# Altium schematic sheet Power.SchDoc
size A3; SheetNumber: 3; SheetTotal: 23
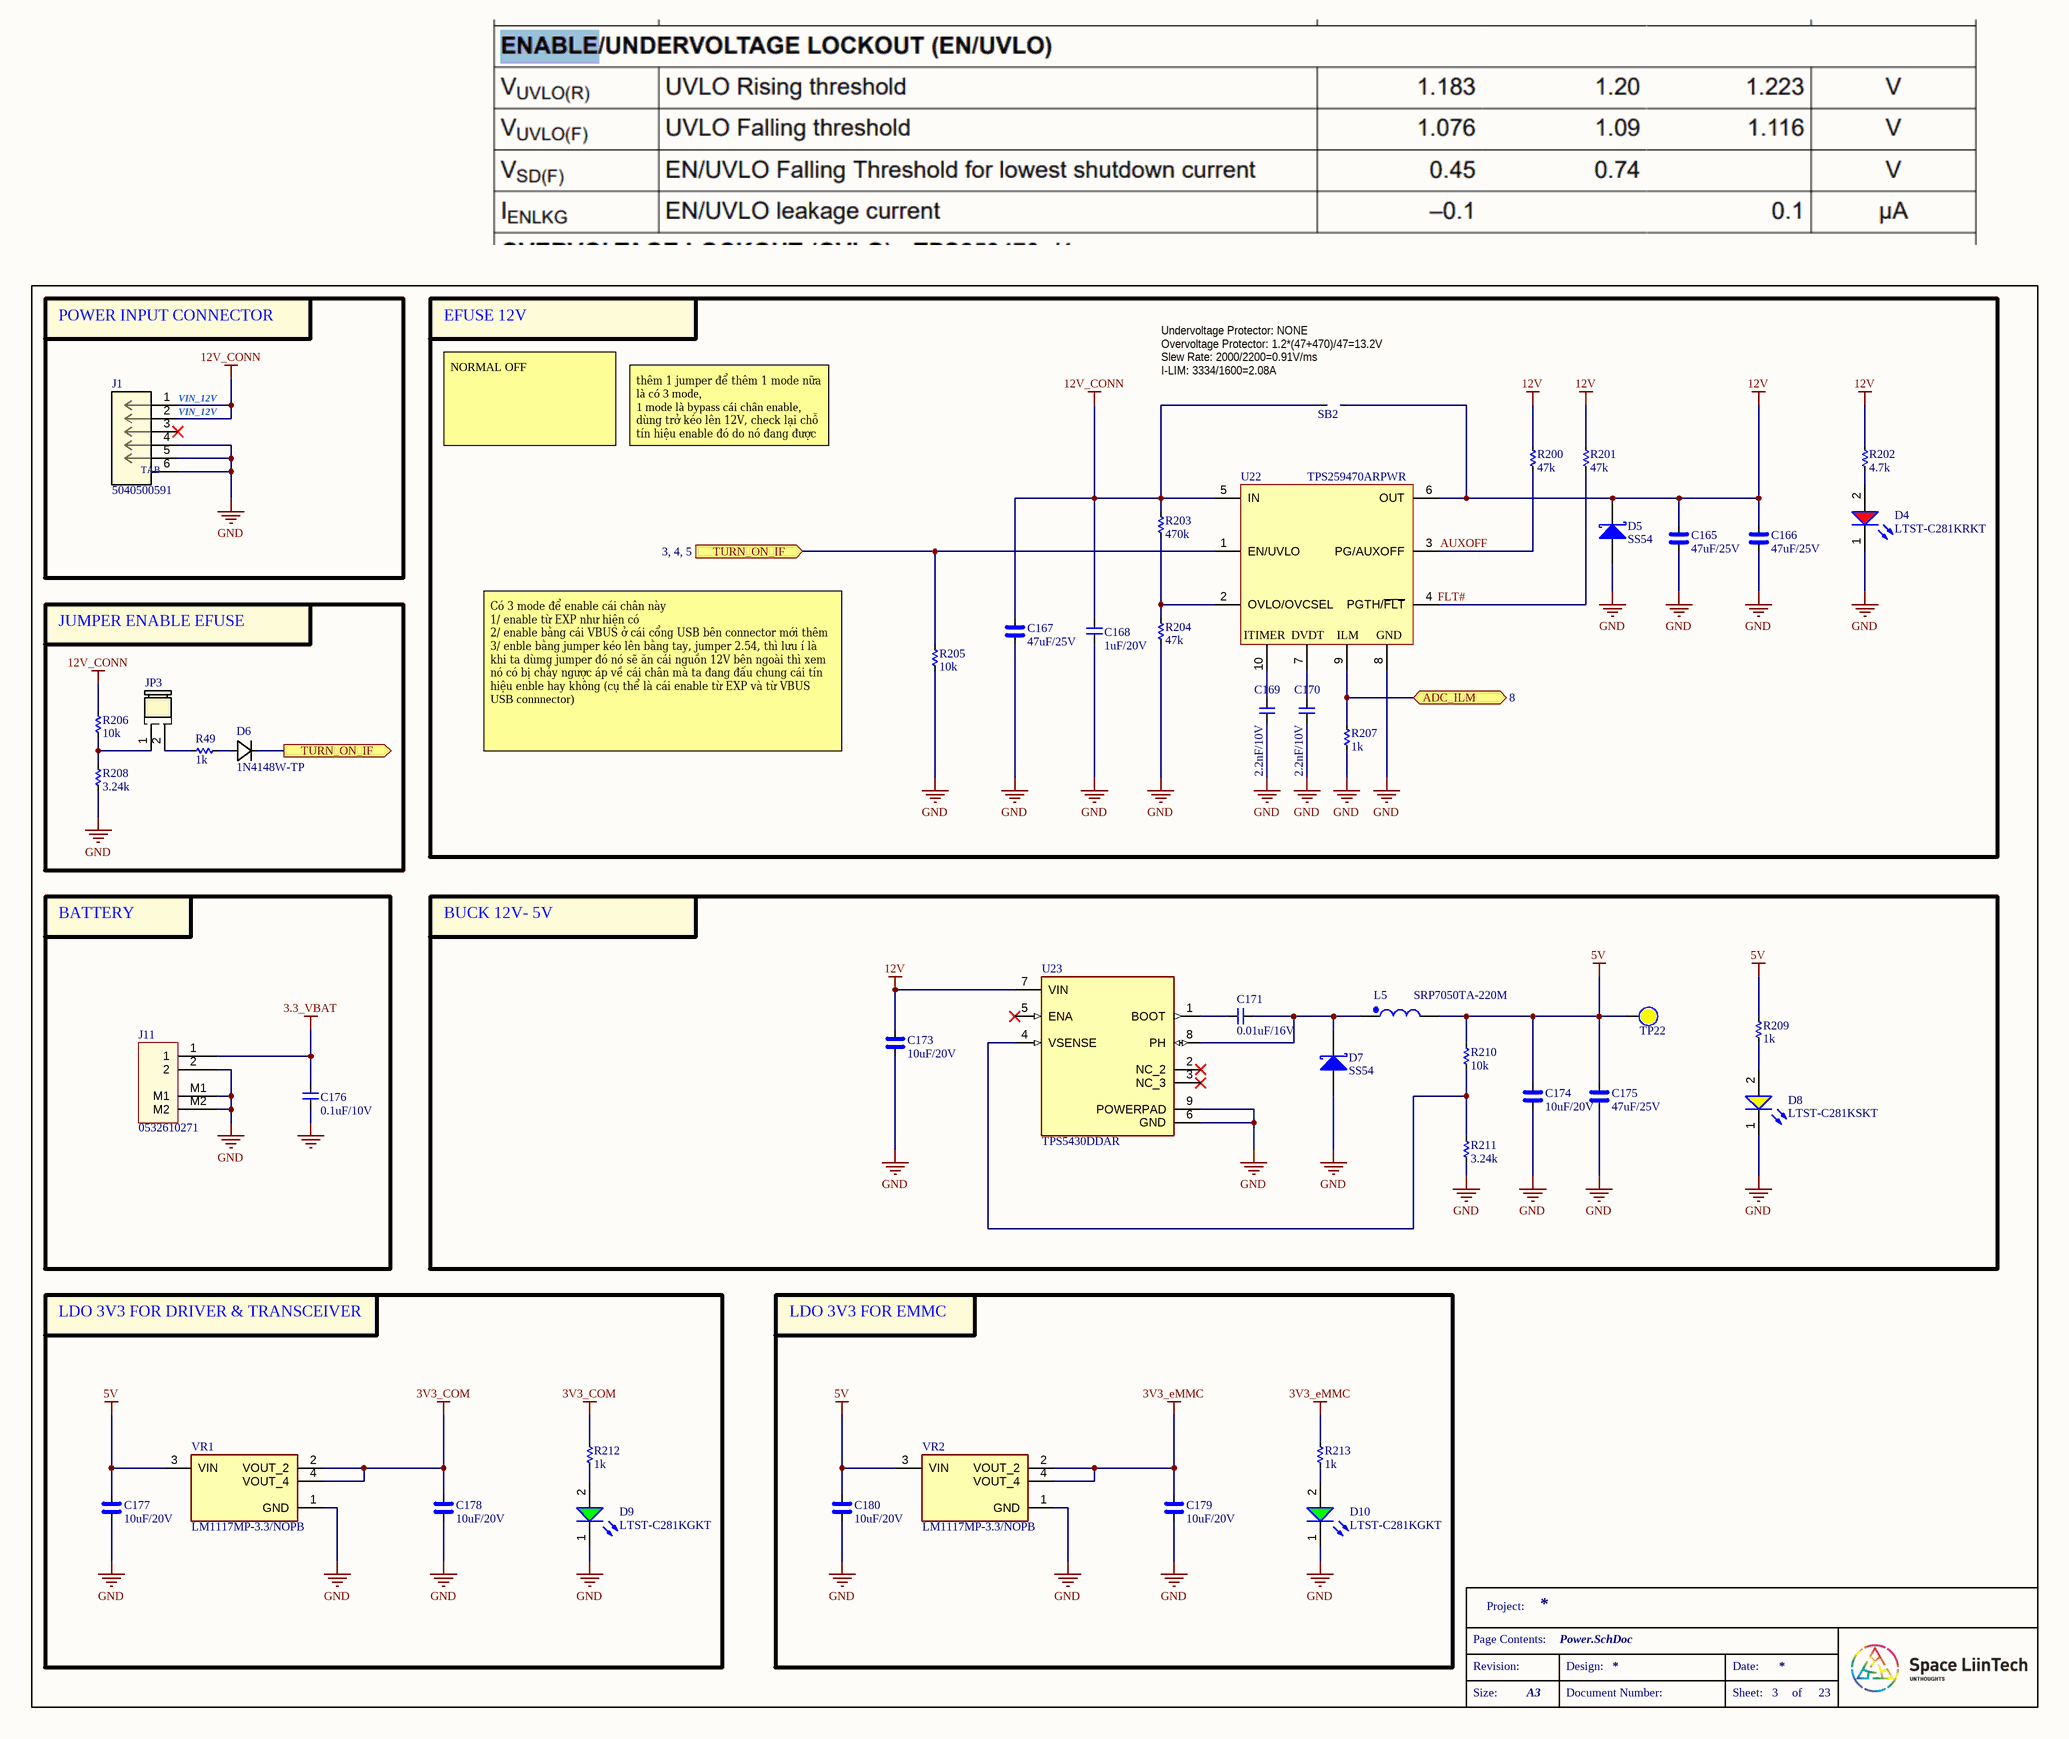
[diagram p0: Power.SchDoc]

## Parts
C165  47uF/25V  [CAP_C_3225X80]
C166  47uF/25V  [CAP_C_3225X80]
C167  47uF/25V  [CAP_C_3225X80]
C168  1uF/20V  [CAP_C_1005X50_L]
C169  2.2nF/10V  [CAP_C_1005X50_L]
C170  2.2nF/10V  [CAP_C_1005X50_L]
C171  0.01uF/16V  [CAP_C_1608X80_L]
C173  10uF/20V  [CAP_C_2012X110]
C174  10uF/20V  [CAP_C_2012X110]
C175  47uF/25V  [CAP_C_3225X80]
C176  0.1uF/10V  [CAP_C_1005X50_L]
C177  10uF/20V  [CAP_C_2012X110]
C178  10uF/20V  [CAP_C_2012X110]
C179  10uF/20V  [CAP_C_2012X110]
C180  10uF/20V  [CAP_C_2012X110]
D4  LTST-C281KRKT  [LED_0402]
D5  SS54  [DO-214AC_SMA]
D6  1N4148W-TP  [SOD123_MCC]
D7  SS54  [DO-214AC_SMA]
D8  LTST-C281KSKT  [LED_0402]
D9  LTST-C281KGKT  [LED_0402]
D10  LTST-C281KGKT  [LED_0402]
J1  5040500591  [5040500591]
J11  0532610271  [MOLEX_0532610271]
JP3  JUMPER_254P_NOPLACE  [JUMPER_254P_2X1_ANGLE]  (value not drawn)
L5  SRP7050TA-220M  [SRP7050TA-220M]
R49  1k  [RES_C_1005x30_L]
R200  47k  [RES_C_1005x30_L]
R201  47k  [RES_C_1005x30_L]
R202  4.7k  [RES_C_1005x30_L]
R203  470k  [RES_C_1005x30_L]
R204  47k  [RES_C_1005x30_L]
R205  10k  [RES_C_1005x30_L]
R206  10k  [RES_C_1005x30_L]
R207  1k  [RES_C_1005x30_L]
R208  3.24k  [RES_C_1005x30_L]
R209  1k  [RES_C_1005x30_L]
R210  10k  [RES_C_1005x30_L]
R211  3.24k  [RES_C_1005x30_L]
R212  1k  [RES_C_1005x30_L]
R213  1k  [RES_C_1005x30_L]
SB2  JUMPER  [JUMPER_1608]  (value not drawn)
TP22  (no value)  [Test point]  (no BOM)
U22  TPS259470ARPWR  [VQFN-HR-10]
U23  TPS5430DDAR  [CONV_TPS5430DDAR]
VR1  LM1117MP-3.3/NOPB  [VREG_LM1117MP-3.3/NOPB]
VR2  LM1117MP-3.3/NOPB  [VREG_LM1117MP-3.3/NOPB]

## Blocks framed on the sheet
POWER INPUT CONNECTOR: J1
EFUSE 12V: C165-C170 D4 D5 R200-R205 R207 SB2 U22
JUMPER ENABLE EFUSE: D6 JP3 R49 R206 R208
BATTERY: C176 J11
BUCK 12V- 5V: C171 C173-C175 D7 D8 L5 R209-R211 TP22 U23
LDO 3V3 FOR DRIVER & TRANSCEIVER: C177 C178 D9 R212 VR1
LDO 3V3 FOR EMMC: C179 C180 D10 R213 VR2

## Ports
ADC_ILM (bidir, see 8), TURN_ON_IF (in, see 3, 4, 5), TURN_ON_IF (out, see 3, 4, 5)

## Nets
3.3_VBAT: C176.1 J11.1
3V3_COM: C178.2 R212.2 VR1.2(VOUT_2) VR1.4(VOUT_4)
3V3_eMMC: C179.2 R213.2 VR2.2(VOUT_2) VR2.4(VOUT_4)
5V: C174.2 C175.2 C177.2 C180.2 L5.2 R209.2 R210.1 TP22.0 VR1.3(VIN) VR2.3(VIN)
12V: C165.2 C166.2 C173.2 D5.1(K) R200.2 R201.2 R202.2 SB2.2 U22.6(OUT) U23.7(VIN)
12V_CONN: C167.2 C168.2 J1.1 J1.2 R203.1 R206.2 SB2.1 U22.5(IN)
GND: C165.1 C166.1 C167.1 C168.1 C169.1 C170.1 C173.1 C174.1 C175.1 C176.2 C177.1 C178.1 C179.1 C180.1 D4.1(K) D5.2(A) D7.2(A) D8.1(K) D9.1(K) D10.1(K) J1.4 J1.5 J1.6 J11.2 J11.M1 J11.M2 R204.2 R205.2 R207.2 R208.2 R211.2 U22.8(GND) U23.6(GND) U23.9(POWERPAD) VR1.1(GND) VR2.1(GND)
ADC_ILM: R207.1 U22.9(ILM) ; port ADC_ILM
AUXOFF: R200.1 U22.3(PG/AUXOFF)
FLT#: R201.1 U22.4(PGTH/~{FLT})
TURN_ON_IF: D6.1 R205.1 U22.1(EN/UVLO) ; port TURN_ON_IF
NetC169_2: C169.2 U22.10(ITIMER)
NetC170_2: C170.2 U22.7(DVDT)
NetC171_1: C171.1 D7.1(K) L5.1 U23.8(PH)
NetC171_2: C171.2 U23.1(BOOT)
NetD4_2: D4.2(A) R202.1
NetD6_2: D6.2 R49.2
NetD8_2: D8.2(A) R209.1
NetD9_2: D9.2(A) R212.1
NetD10_2: D10.2(A) R213.1
NetJP3_1: JP3.1 R206.1 R208.1
NetJP3_2: JP3.2 R49.1
NetR203_2: R203.2 R204.1 U22.2(OVLO/OVCSEL)
NetR210_2: R210.2 R211.1 U23.4(VSENSE)

Not connected (* = marked no-connect by the designer): J1 3*; U23 2(NC_2)* 3(NC_3)* 5(ENA)*

## Notes on the sheet
- Undervoltage Protector: NONE
- Overvoltage Protector: 1.2*(47+470)/47=13.2V
- (near SB2) Slew Rate: 2000/2200=0.91V/ms
- (near J1) VIN_12V
- (near SB2) I-LIM: 3334/1600=2.08A
- NORMAL OFF
- thêm 1 jumper để thêm 1 mode nữa là có 3 mode,
  1 mode là bypass cái chân enable, dùng trở kéo lên 12V, check lại chỗ tín hiệu enable đó do nó đang được enable bởi EXP và cái VBUS bên connector
- Có 3 mode để enable cái chân này
  1/ enable từ EXP như hiện có
  2/ enable bằng cái VBUS ở cái cổng USB bên connector mới thêm
  3/ enble bằng jumper kéo lên bằng tay, jumper 2.54, thì lưu í là khi ta dùmg jumper đó nó sẽ ăn cái nguồn 12V bên ngoài thì xem nó có bị chảy ngược áp về cái chân mà ta đang đấu chung cái tín hiệu enble hay không (cụ thể là cái enable từ EXP và từ VBUS USB connnector)
- Project:
- Page Contents:
- Revision:
- Design:
- Date:
- Size:
- A3
- Document Number:
- Sheet:
- of
- (in symbol 5040500591) TAB

## Library data of the parts
C165-C167 C173-C175 C177-C180 = _CAP_C_High_2: CAP CHIP High Value
C168-C171 C176 = _CAP_C_2: CAP CHIP
D4 = LED_RED: LED RED CLEAR 0402 SMD
D5 D7 = SS54: DIODE SCHOTTKY 40V 5A SMA; MPN: SS34; Solder: SMT; Value: SS34; MFR: *
D6 = 1N4148W-TP: Description; Manufacturer_Name: MCC; Copyright: Copyright (C) 2026 Ultra Librarian. All rights reserved.; Manufacturer_Part_Number: 1N4148W-TP
D8 = LED_YELLOW: LED YELLOW CLEAR 0402 SMD
D9 D10 = LED_GREEN: LED GREEN CLEAR 0402 SMD
J1 = 5040500591: 1.50mm Pitch, Pico-Lock PCB Header, Single Row, Right-Angle, Surface Mount, Gold (Au) Plating, Positive Lock, 5 Circuits, Tape and Reel; Manufacturer_Name: Molex Connector Corporation; Copyright: Copyright (C) 2025 Ultra Librarian. All rights reserved.; Manufacturer_Part_Number: 5040500591; RefDes: RefDes; Type: Type
J11 = Header 2x1_2M
L5 = _IND: FIXED IND 22UH 2.5A 170 MOHM SMD
R49 R200-R213 = _RES_B_2: RES
TP22 = Test Point: Solder: NF
U23 = TPS5430DDAR: 5.5V to 36V Input, 3A, 500kHz Step-Down Converter; MF: Texas Instruments; Package: HSOIC-8 Texas Instruments; Check_prices: https://www.snapeda.com/parts/TPS5430DDAR/Texas+Instruments/view-part/?ref=eda; Value: *; Purchase-URL: https://pricing.snapeda.com/search/part/TPS5430DDAR/?ref=eda; Availability: In Stock; SnapEDA_Link: https://www.snapeda.com/parts/TPS5430DDAR/Texas+Instruments/view-part/?ref=snap; MP: TPS5430DDAR; Price: None
VR1 VR2 = LM1117MP-3.3/NOPB: 800-mA 15-V linear voltage regulator; MF: Texas Instruments; SnapEDA_Link: https://www.snapeda.com/parts/LM1117MP-3.3/NOPB/Texas+Instruments/view-part/?ref=snap; Package: SOT-223-4 Texas Instruments; Value: *; MP: LM1117MP-3.3/NOPB; Check_prices: https://www.snapeda.com/parts/LM1117MP-3.3/NOPB/Texas+Instruments/view-part/?ref=eda